# Altium schematic sheet Sheet1.SchDoc
size A4
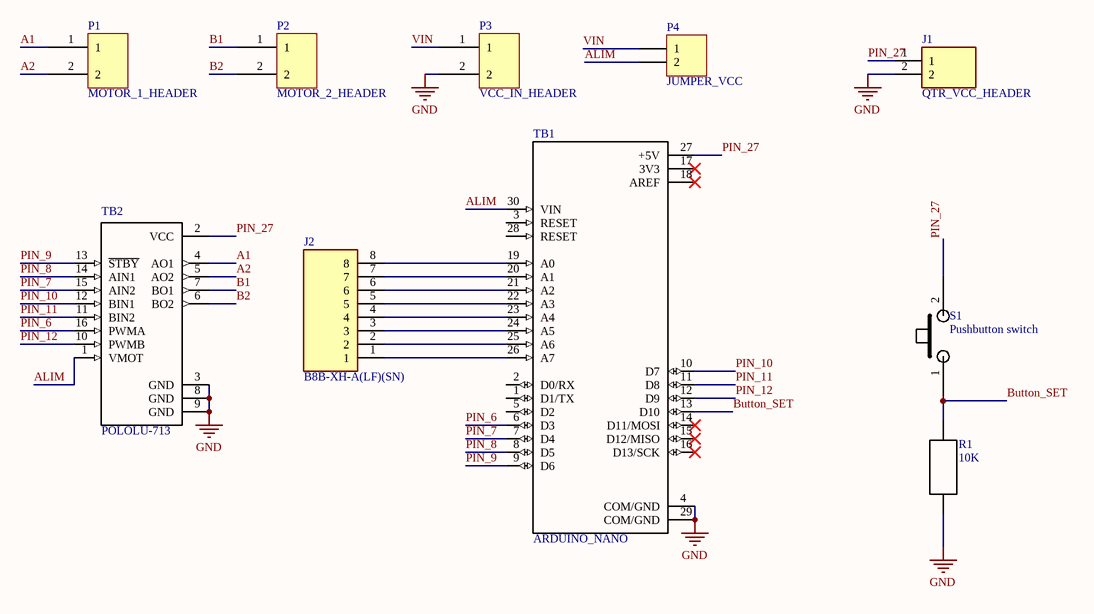
[diagram p0: Sheet1.SchDoc]

## Parts
J1  QTR_VCC_HEADER  [SHDR2W64P0X250_1X2_740X575X700P]
J2  B8B-XH-A(LF)(SN)  [HDRV8W64P0X250_1X8_2240X575X700P]
P1  MOTOR_1_HEADER  [KRE-2 CONNECTOR]
P2  MOTOR_2_HEADER  [KRE-2 CONNECTOR]
P3  VCC_IN_HEADER  [KRE-2 CONNECTOR]
P4  JUMPER_VCC  [HDR1X2]
R1  10K  [Axial 0.4(resistor)]
S1  Pushbutton switch  [Pushbutton]
TB1  ARDUINO_NANO  [*SHIELD_ARDUINO_NANO]
TB2  POLOLU-713  [*SHIELD_POLOLU-713]

## Nets
GND: J1.2 P3.2 R1.1 TB1.4(COM/GND) TB1.29(COM/GND) TB2.3(GND) TB2.8(GND) TB2.9(GND)
A1: P1.1 TB2.4(AO1)
A2: P1.2 TB2.5(AO2)
ALIM: P4.2 TB1.30(VIN) TB2.1(VMOT)
B1: P2.1 TB2.7(BO1)
B2: P2.2 TB2.6(BO2)
Button_SET: R1.2 S1.1(A) TB1.13(D10)
PIN_6: TB1.6(D3) TB2.16(PWMA)
PIN_7: TB1.7(D4) TB2.15(AIN2)
PIN_8: TB1.8(D5) TB2.14(AIN1)
PIN_9: TB1.9(D6) TB2.13(~{STBY})
PIN_10: TB1.10(D7) TB2.12(BIN1)
PIN_11: TB1.11(D8) TB2.11(BIN2)
PIN_12: TB1.12(D9) TB2.10(PWMB)
PIN_27: J1.1 S1.2(B) TB1.27(+5V) TB2.2(VCC)
VIN: P3.1 P4.1
NetJ2_1: J2.1 TB1.26(A7)
NetJ2_2: J2.2 TB1.25(A6)
NetJ2_3: J2.3 TB1.24(A5)
NetJ2_4: J2.4 TB1.23(A4)
NetJ2_5: J2.5 TB1.22(A3)
NetJ2_6: J2.6 TB1.21(A2)
NetJ2_7: J2.7 TB1.20(A1)
NetJ2_8: J2.8 TB1.19(A0)

Not connected (* = marked no-connect by the designer): TB1 1(D1/TX) 2(D0/RX) 3(RESET) 5(D2) 14(D11/MOSI)* 15(D12/MISO)* 16(D13/SCK)* 17(3V3)* 18(AREF)* 28(RESET)

## Library data of the parts
J1 = B2B-XH-A(LF)(SN): Connector; Manufacturer_Name: JST Sales America; Datasheet Link: http://www.jst-mfg.com/product/pdf/eng/eXH.pdf; Height: 7mm; Manufacturer_Part_Number: B2B-XH-A(LF)(SN)
J2 = B8B-XH-A(LF)(SN): Connector; Manufacturer_Name: JST (JAPAN SOLDERLESS TERMINALS); Datasheet Link: http://docs-emea.rs-online.com/webdocs/1357/0900766b81357f2f.pdf; Height: 7mm; Manufacturer_Part_Number: B8B-XH-A(LF)(SN); RS Part Number: 8201576P; RS Price/Stock: http://uk.rs-online.com/web/p/products/8201576P
P1-P3 = KRE-2 CONNECTOR: KRE _CONNECTOR; eVendor: *; eVendorPart#: *; eVendorPrice: *; Manufacturer: *; MOQ: *; MSRP: *; Part#: *
P4 = Header 2: Header, 2-Pin; LatestRevisionDate: 17-Jul-2002; LatestRevisionNote: Re-released for DXP Platform.; Publisher: Altium Limited
R1 = Resistor 10K: RES 10K OHM 1/4W 5% AXIAL; eVendorPart#: 10KQTR-ND; Manufacturer: Yageo; Part#: CFR-25JR-52-10K; eVendor: Digikey; eVendorPrice: 0.10000; MOQ: 1; MSRP: *
S1 = Pushbutton switch: eVendorPart#: mota; eVendor: david; eVendorPrice: deti; Manufacturer: *; MOQ: *; MSRP: *; Part#: *
TB1 = ARDUINO_NANO: Dev.kit: Arduino; UART; ICSP, USB B mini, pin strips; MP: ARDUINO NANO; SnapEDA_Link: https://www.snapeda.com/parts/ARDUINO%20NANO/Arduino/view-part/?ref=snap; Availability: Unavailable; Package: None; Price: None; MF: Arduino; Value: *
TB2 = POLOLU-713: DC-motor driver; IC: TB6612FNG; 100kHz; 1A; Uin mot: 4.5; MF: Pololu; MP: POLOLU-713; SnapEDA_Link: https://www.snapeda.com/parts/POLOLU-713/Pololu/view-part/?ref=snap; Availability: Unavailable; Package: None; Price: None; Value: *